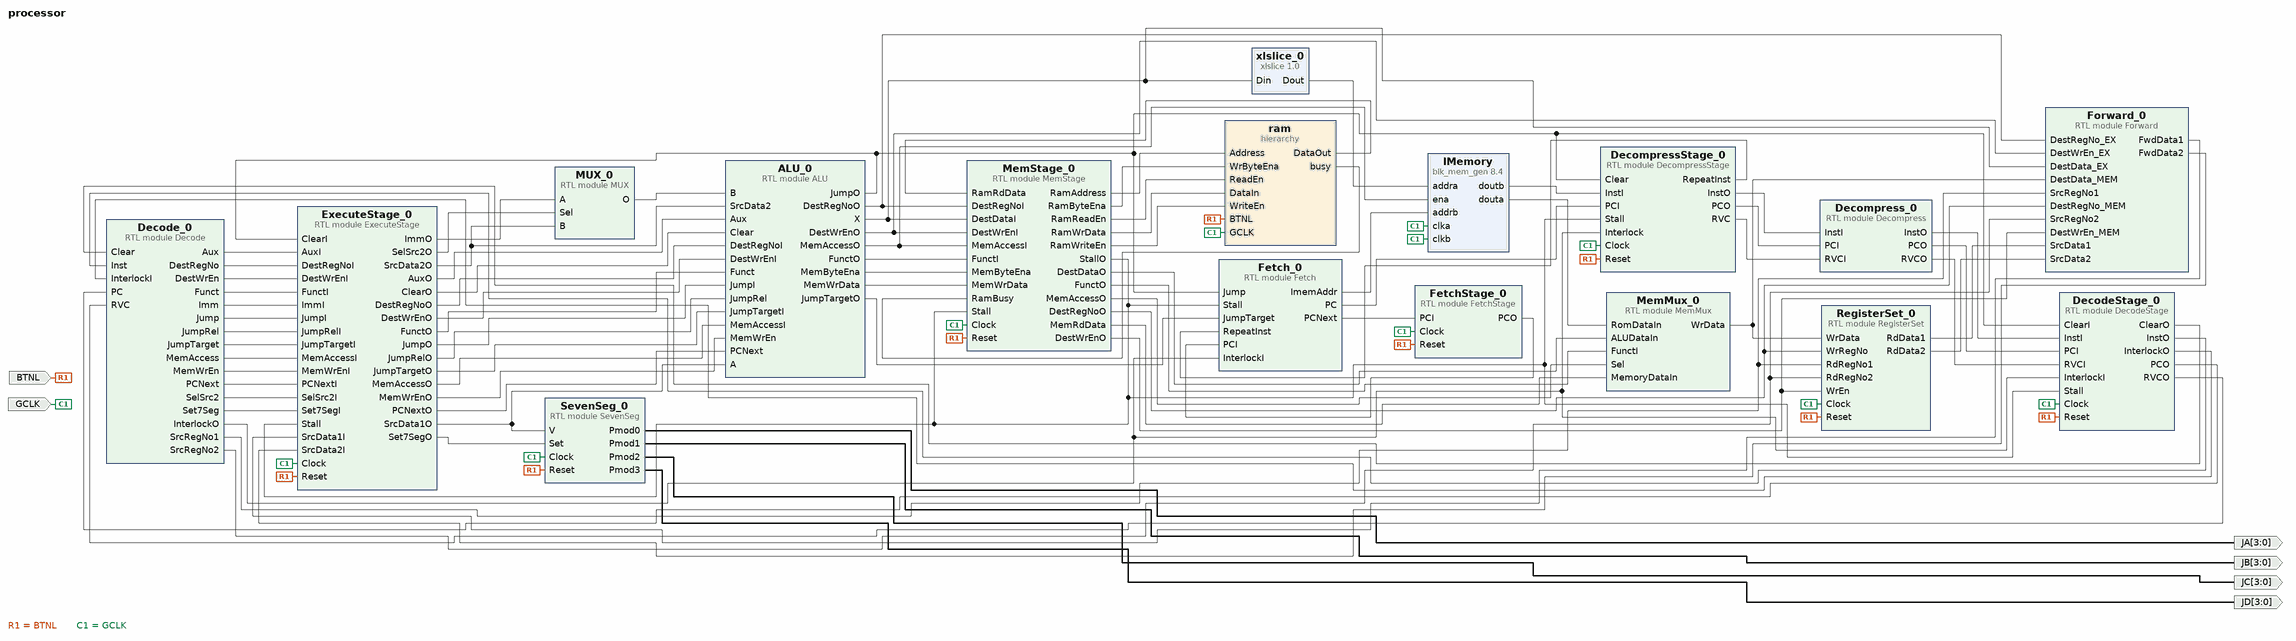
[diagram p0: block diagram of the top level]
# Vivado block design processor, xc7z020clg484-1, Vivado 2021.2
create_bd_design processor

create_bd_port -dir I GCLK
create_bd_port -dir I BTNL
create_bd_port -dir O -from 3 -to 0 JA
create_bd_port -dir O -from 3 -to 0 JB
create_bd_port -dir O -from 3 -to 0 JC
create_bd_port -dir O -from 3 -to 0 JD

create_bd_cell -type hier ram
create_bd_cell -type ip -vlnv xilinx.com:ip:blk_mem_gen:8.4 IMemory
set_property -dict [list \
  CONFIG.Coe_File ../../../../../../../../Downloads/test_files/compressed.coe \
  CONFIG.Enable_32bit_Address false \
  CONFIG.Enable_B Always_Enabled \
  CONFIG.Load_Init_File true \
  CONFIG.Memory_Type Dual_Port_ROM \
  CONFIG.Port_A_Write_Rate 0 \
  CONFIG.Port_B_Clock 100 \
  CONFIG.Port_B_Enable_Rate 100 \
  CONFIG.Register_PortA_Output_of_Memory_Primitives false \
  CONFIG.Register_PortB_Output_of_Memory_Primitives false \
  CONFIG.Use_RSTA_Pin false \
  CONFIG.Write_Depth_A 1024 \
  CONFIG.use_bram_block Stand_Alone \
] [get_bd_cells IMemory]
create_bd_cell -type ip -vlnv xilinx.com:ip:xlslice:1.0 xlslice_0
set_property -dict {CONFIG.DIN_FROM 11 CONFIG.DIN_TO 2 CONFIG.DOUT_WIDTH 10} [get_bd_cells xlslice_0]
create_bd_cell -type module -reference MUX MUX_0
create_bd_cell -type module -reference FetchStage FetchStage_0
create_bd_cell -type module -reference ExecuteStage ExecuteStage_0
create_bd_cell -type module -reference Forward Forward_0
create_bd_cell -type module -reference RegisterSet RegisterSet_0
create_bd_cell -type module -reference SevenSeg SevenSeg_0
create_bd_cell -type module -reference ALU ALU_0
create_bd_cell -type module -reference MemMux MemMux_0
create_bd_cell -type module -reference MemStage MemStage_0
create_bd_cell -type module -reference DecodeStage DecodeStage_0
create_bd_cell -type module -reference Decode Decode_0
create_bd_cell -type module -reference DecompressStage DecompressStage_0
create_bd_cell -type module -reference Decompress Decompress_0
create_bd_cell -type module -reference Fetch Fetch_0

# ---- hierarchy /ram ----
current_bd_instance /ram
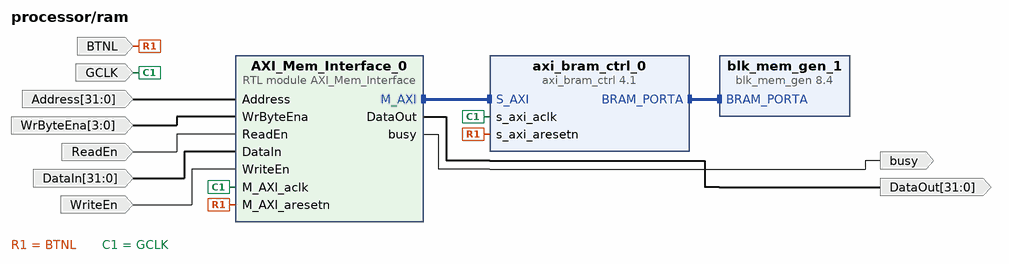
[diagram p1: block diagram inside /ram]
create_bd_pin -dir I GCLK
create_bd_pin -dir I BTNL
create_bd_pin -dir I ReadEn
create_bd_pin -dir I WriteEn
create_bd_pin -dir I -from 3 -to 0 WrByteEna
create_bd_pin -dir I -from 31 -to 0 Address
create_bd_pin -dir I -from 31 -to 0 DataIn
create_bd_pin -dir O -from 31 -to 0 DataOut
create_bd_pin -dir O busy

create_bd_cell -type ip -vlnv xilinx.com:ip:axi_bram_ctrl:4.1 axi_bram_ctrl_0
set_property -dict {CONFIG.PROTOCOL AXI4LITE CONFIG.SINGLE_PORT_BRAM 1} [get_bd_cells axi_bram_ctrl_0]
create_bd_cell -type ip -vlnv xilinx.com:ip:blk_mem_gen:8.4 blk_mem_gen_1
create_bd_cell -type module -reference AXI_Mem_Interface AXI_Mem_Interface_0

# ---- connections ----

current_bd_instance /ram
connect_bd_intf_net [get_bd_intf_pins AXI_Mem_Interface_0/M_AXI] [get_bd_intf_pins axi_bram_ctrl_0/S_AXI]
connect_bd_intf_net [get_bd_intf_pins axi_bram_ctrl_0/BRAM_PORTA] [get_bd_intf_pins blk_mem_gen_1/BRAM_PORTA]
connect_bd_net [get_bd_pins AXI_Mem_Interface_0/DataOut] [get_bd_pins DataOut]
connect_bd_net [get_bd_pins AXI_Mem_Interface_0/busy] [get_bd_pins busy]
connect_bd_net -net BTNL_1 [get_bd_pins BTNL] [get_bd_pins axi_bram_ctrl_0/s_axi_aresetn] [get_bd_pins AXI_Mem_Interface_0/M_AXI_aresetn]
connect_bd_net [get_bd_pins GCLK] [get_bd_pins axi_bram_ctrl_0/s_axi_aclk] [get_bd_pins AXI_Mem_Interface_0/M_AXI_aclk]
connect_bd_net -net MemStage_0_RamAddress [get_bd_pins Address] [get_bd_pins AXI_Mem_Interface_0/Address]
connect_bd_net -net MemStage_0_RamByteEn [get_bd_pins WrByteEna] [get_bd_pins AXI_Mem_Interface_0/WrByteEna]
connect_bd_net -net MemStage_0_RamReadEn [get_bd_pins ReadEn] [get_bd_pins AXI_Mem_Interface_0/ReadEn]
connect_bd_net -net MemStage_0_RamWrData [get_bd_pins DataIn] [get_bd_pins AXI_Mem_Interface_0/DataIn]
connect_bd_net -net MemStage_0_RamWriteEn [get_bd_pins WriteEn] [get_bd_pins AXI_Mem_Interface_0/WriteEn]
set_property HDL_ATTRIBUTE.DEBUG true [get_bd_nets BTNL_1]

current_bd_instance /
connect_bd_net [get_bd_pins ALU_0/DestRegNoO] [get_bd_pins Forward_0/DestRegNo_EX] [get_bd_pins MemStage_0/DestRegNoI]
connect_bd_net [get_bd_pins ALU_0/DestWrEnO] [get_bd_pins Forward_0/DestWrEn_EX] [get_bd_pins MemStage_0/DestWrEnI]
connect_bd_net [get_bd_pins ALU_0/FunctO] [get_bd_pins MemStage_0/FunctI]
connect_bd_net [get_bd_pins ALU_0/JumpO] \
  [get_bd_pins ExecuteStage_0/ClearI] [get_bd_pins DecodeStage_0/ClearI] [get_bd_pins DecompressStage_0/Clear] \
  [get_bd_pins Fetch_0/Jump]
connect_bd_net [get_bd_pins ALU_0/JumpTargetO] [get_bd_pins Fetch_0/JumpTarget]
connect_bd_net [get_bd_pins ALU_0/MemAccessO] [get_bd_pins IMemory/ena] [get_bd_pins MemStage_0/MemAccessI]
connect_bd_net [get_bd_pins ALU_0/MemByteEna] [get_bd_pins MemStage_0/MemByteEna]
connect_bd_net -net ALU_0_MemWrData [get_bd_pins ALU_0/MemWrData] [get_bd_pins MemStage_0/MemWrData]
connect_bd_net -net ALU_0_X [get_bd_pins ALU_0/X] [get_bd_pins xlslice_0/Din] [get_bd_pins Forward_0/DestData_EX] [get_bd_pins MemStage_0/DestDataI]
connect_bd_net -net AXI_Mem_Interface_0_DataOut [get_bd_pins ram/DataOut] [get_bd_pins MemStage_0/RamRdData]
connect_bd_net -net AXI_Mem_Interface_0_busy [get_bd_pins ram/busy] [get_bd_pins MemStage_0/RamBusy]
connect_bd_net -net BTNL_1 [get_bd_ports BTNL] \
  [get_bd_pins ram/BTNL] [get_bd_pins FetchStage_0/Reset] [get_bd_pins ExecuteStage_0/Reset] \
  [get_bd_pins RegisterSet_0/Reset] [get_bd_pins SevenSeg_0/Reset] [get_bd_pins MemStage_0/Reset] \
  [get_bd_pins DecodeStage_0/Reset] [get_bd_pins DecompressStage_0/Reset]
connect_bd_net [get_bd_pins DecodeStage_0/ClearO] [get_bd_pins Decode_0/Clear]
connect_bd_net -net DecodeStage_0_InstO [get_bd_pins DecodeStage_0/InstO] [get_bd_pins Decode_0/Inst]
connect_bd_net [get_bd_pins DecodeStage_0/InterlockO] [get_bd_pins Decode_0/InterlockI]
connect_bd_net -net DecodeStage_0_PCO [get_bd_pins DecodeStage_0/PCO] [get_bd_pins Decode_0/PC]
connect_bd_net [get_bd_pins DecodeStage_0/RVCO] [get_bd_pins Decode_0/RVC]
connect_bd_net [get_bd_pins Decode_0/Aux] [get_bd_pins ExecuteStage_0/AuxI]
connect_bd_net [get_bd_pins Decode_0/DestRegNo] [get_bd_pins ExecuteStage_0/DestRegNoI]
connect_bd_net [get_bd_pins Decode_0/DestWrEn] [get_bd_pins ExecuteStage_0/DestWrEnI]
connect_bd_net [get_bd_pins Decode_0/Funct] [get_bd_pins ExecuteStage_0/FunctI]
connect_bd_net [get_bd_pins Decode_0/Imm] [get_bd_pins ExecuteStage_0/ImmI]
connect_bd_net [get_bd_pins Decode_0/InterlockO] \
  [get_bd_pins DecodeStage_0/InterlockI] [get_bd_pins DecompressStage_0/Interlock] [get_bd_pins Fetch_0/InterlockI]
connect_bd_net [get_bd_pins Decode_0/Jump] [get_bd_pins ExecuteStage_0/JumpI]
connect_bd_net [get_bd_pins Decode_0/JumpRel] [get_bd_pins ExecuteStage_0/JumpRelI]
connect_bd_net [get_bd_pins Decode_0/JumpTarget] [get_bd_pins ExecuteStage_0/JumpTargetI]
connect_bd_net [get_bd_pins Decode_0/MemAccess] [get_bd_pins ExecuteStage_0/MemAccessI]
connect_bd_net [get_bd_pins Decode_0/MemWrEn] [get_bd_pins ExecuteStage_0/MemWrEnI]
connect_bd_net [get_bd_pins Decode_0/PCNext] [get_bd_pins ExecuteStage_0/PCNextI]
connect_bd_net [get_bd_pins Decode_0/SelSrc2] [get_bd_pins ExecuteStage_0/SelSrc2I]
connect_bd_net [get_bd_pins Decode_0/Set7Seg] [get_bd_pins ExecuteStage_0/Set7SegI]
connect_bd_net [get_bd_pins Decode_0/SrcRegNo1] [get_bd_pins Forward_0/SrcRegNo1] [get_bd_pins RegisterSet_0/RdRegNo1]
connect_bd_net [get_bd_pins Decode_0/SrcRegNo2] [get_bd_pins Forward_0/SrcRegNo2] [get_bd_pins RegisterSet_0/RdRegNo2]
connect_bd_net [get_bd_pins DecompressStage_0/InstO] [get_bd_pins Decompress_0/InstI]
connect_bd_net [get_bd_pins DecompressStage_0/PCO] [get_bd_pins Decompress_0/PCI]
connect_bd_net [get_bd_pins DecompressStage_0/RVC] [get_bd_pins Decompress_0/RVCI]
connect_bd_net [get_bd_pins DecompressStage_0/RepeatInst] [get_bd_pins Fetch_0/RepeatInst]
connect_bd_net [get_bd_pins Decompress_0/InstO] [get_bd_pins DecodeStage_0/InstI]
connect_bd_net [get_bd_pins Decompress_0/PCO] [get_bd_pins DecodeStage_0/PCI]
connect_bd_net [get_bd_pins Decompress_0/RVCO] [get_bd_pins DecodeStage_0/RVCI]
connect_bd_net [get_bd_pins ExecuteStage_0/AuxO] [get_bd_pins ALU_0/Aux]
connect_bd_net [get_bd_pins ExecuteStage_0/ClearO] [get_bd_pins ALU_0/Clear]
connect_bd_net [get_bd_pins ExecuteStage_0/DestRegNoO] [get_bd_pins ALU_0/DestRegNoI]
connect_bd_net [get_bd_pins ExecuteStage_0/DestWrEnO] [get_bd_pins ALU_0/DestWrEnI]
connect_bd_net -net ExecuteStage_0_FunctO [get_bd_pins ExecuteStage_0/FunctO] [get_bd_pins ALU_0/Funct]
connect_bd_net [get_bd_pins ExecuteStage_0/ImmO] [get_bd_pins MUX_0/A]
connect_bd_net [get_bd_pins ExecuteStage_0/JumpO] [get_bd_pins ALU_0/JumpI]
connect_bd_net [get_bd_pins ExecuteStage_0/JumpRelO] [get_bd_pins ALU_0/JumpRel]
connect_bd_net [get_bd_pins ExecuteStage_0/JumpTargetO] [get_bd_pins ALU_0/JumpTargetI]
connect_bd_net -net ExecuteStage_0_MemAccessO [get_bd_pins ExecuteStage_0/MemAccessO] [get_bd_pins ALU_0/MemAccessI]
connect_bd_net -net ExecuteStage_0_MemWrEnO [get_bd_pins ExecuteStage_0/MemWrEnO] [get_bd_pins ALU_0/MemWrEn]
connect_bd_net [get_bd_pins ExecuteStage_0/PCNextO] [get_bd_pins ALU_0/PCNext]
connect_bd_net [get_bd_pins ExecuteStage_0/SelSrc2O] [get_bd_pins MUX_0/Sel]
connect_bd_net [get_bd_pins ExecuteStage_0/Set7SegO] [get_bd_pins SevenSeg_0/Set]
connect_bd_net -net ExecuteStage_0_SrcData1O [get_bd_pins ExecuteStage_0/SrcData1O] [get_bd_pins SevenSeg_0/V] [get_bd_pins ALU_0/A]
connect_bd_net [get_bd_pins ExecuteStage_0/SrcData2O] [get_bd_pins MUX_0/B] [get_bd_pins ALU_0/SrcData2]
connect_bd_net [get_bd_pins FetchStage_0/PCO] [get_bd_pins Fetch_0/PCI]
connect_bd_net [get_bd_pins Fetch_0/ImemAddr] [get_bd_pins IMemory/addrb]
connect_bd_net [get_bd_pins Fetch_0/PC] [get_bd_pins DecompressStage_0/PCI]
connect_bd_net [get_bd_pins Fetch_0/PCNext] [get_bd_pins FetchStage_0/PCI]
connect_bd_net [get_bd_pins Forward_0/FwdData1] [get_bd_pins ExecuteStage_0/SrcData1I]
connect_bd_net [get_bd_pins Forward_0/FwdData2] [get_bd_pins ExecuteStage_0/SrcData2I]
connect_bd_net [get_bd_ports GCLK] \
  [get_bd_pins ram/GCLK] [get_bd_pins IMemory/clka] [get_bd_pins IMemory/clkb] [get_bd_pins FetchStage_0/Clock] \
  [get_bd_pins ExecuteStage_0/Clock] [get_bd_pins RegisterSet_0/Clock] [get_bd_pins SevenSeg_0/Clock] \
  [get_bd_pins MemStage_0/Clock] [get_bd_pins DecodeStage_0/Clock] [get_bd_pins DecompressStage_0/Clock]
connect_bd_net [get_bd_pins IMemory/douta] [get_bd_pins MemMux_0/RomDataIn]
connect_bd_net [get_bd_pins IMemory/doutb] [get_bd_pins DecompressStage_0/InstI]
connect_bd_net -net MUX_0_O [get_bd_pins MUX_0/O] [get_bd_pins ALU_0/B]
connect_bd_net -net MemMux_0_WrData [get_bd_pins MemMux_0/WrData] [get_bd_pins Forward_0/DestData_MEM] [get_bd_pins RegisterSet_0/WrData]
connect_bd_net [get_bd_pins MemStage_0/DestDataO] [get_bd_pins MemMux_0/ALUDataIn]
connect_bd_net [get_bd_pins MemStage_0/DestRegNoO] [get_bd_pins Forward_0/DestRegNo_MEM] [get_bd_pins RegisterSet_0/WrRegNo]
connect_bd_net [get_bd_pins MemStage_0/DestWrEnO] [get_bd_pins Forward_0/DestWrEn_MEM] [get_bd_pins RegisterSet_0/WrEn]
connect_bd_net [get_bd_pins MemStage_0/FunctO] [get_bd_pins MemMux_0/FunctI]
connect_bd_net [get_bd_pins MemStage_0/MemAccessO] [get_bd_pins MemMux_0/Sel]
connect_bd_net [get_bd_pins MemStage_0/MemRdData] [get_bd_pins MemMux_0/MemoryDataIn]
connect_bd_net [get_bd_pins MemStage_0/RamAddress] [get_bd_pins ram/Address]
connect_bd_net -net MemStage_0_RamByteEn [get_bd_pins MemStage_0/RamByteEna] [get_bd_pins ram/WrByteEna]
connect_bd_net [get_bd_pins MemStage_0/RamReadEn] [get_bd_pins ram/ReadEn]
connect_bd_net [get_bd_pins MemStage_0/RamWrData] [get_bd_pins ram/DataIn]
connect_bd_net [get_bd_pins MemStage_0/RamWriteEn] [get_bd_pins ram/WriteEn]
connect_bd_net [get_bd_pins MemStage_0/StallO] \
  [get_bd_pins ExecuteStage_0/Stall] [get_bd_pins MemStage_0/Stall] [get_bd_pins DecodeStage_0/Stall] \
  [get_bd_pins DecompressStage_0/Stall] [get_bd_pins Fetch_0/Stall]
connect_bd_net [get_bd_pins RegisterSet_0/RdData1] [get_bd_pins Forward_0/SrcData1]
connect_bd_net [get_bd_pins RegisterSet_0/RdData2] [get_bd_pins Forward_0/SrcData2]
connect_bd_net [get_bd_pins SevenSeg_0/Pmod0] [get_bd_ports JA]
connect_bd_net [get_bd_pins SevenSeg_0/Pmod1] [get_bd_ports JB]
connect_bd_net [get_bd_pins SevenSeg_0/Pmod2] [get_bd_ports JC]
connect_bd_net [get_bd_pins SevenSeg_0/Pmod3] [get_bd_ports JD]
connect_bd_net [get_bd_pins xlslice_0/Dout] [get_bd_pins IMemory/addra]
set_property HDL_ATTRIBUTE.DEBUG true [get_bd_nets ALU_0_MemWrData]
set_property HDL_ATTRIBUTE.MARK_DEBUG true [get_bd_nets ALU_0_MemWrData]
set_property HDL_ATTRIBUTE.DEBUG true [get_bd_nets ALU_0_X]
set_property HDL_ATTRIBUTE.MARK_DEBUG true [get_bd_nets ALU_0_X]
set_property HDL_ATTRIBUTE.DEBUG true [get_bd_nets BTNL_1]
set_property HDL_ATTRIBUTE.MARK_DEBUG true [get_bd_nets BTNL_1]
set_property HDL_ATTRIBUTE.DEBUG true [get_bd_nets DecodeStage_0_InstO]
set_property HDL_ATTRIBUTE.MARK_DEBUG true [get_bd_nets DecodeStage_0_InstO]
set_property HDL_ATTRIBUTE.DEBUG true [get_bd_nets DecodeStage_0_PCO]
set_property HDL_ATTRIBUTE.MARK_DEBUG true [get_bd_nets DecodeStage_0_PCO]
set_property HDL_ATTRIBUTE.DEBUG true [get_bd_nets ExecuteStage_0_FunctO]
set_property HDL_ATTRIBUTE.MARK_DEBUG true [get_bd_nets ExecuteStage_0_FunctO]
set_property HDL_ATTRIBUTE.DEBUG true [get_bd_nets ExecuteStage_0_MemAccessO]
set_property HDL_ATTRIBUTE.MARK_DEBUG true [get_bd_nets ExecuteStage_0_MemAccessO]
set_property HDL_ATTRIBUTE.DEBUG true [get_bd_nets ExecuteStage_0_MemWrEnO]
set_property HDL_ATTRIBUTE.MARK_DEBUG true [get_bd_nets ExecuteStage_0_MemWrEnO]
set_property HDL_ATTRIBUTE.DEBUG true [get_bd_nets ExecuteStage_0_SrcData1O]
set_property HDL_ATTRIBUTE.MARK_DEBUG true [get_bd_nets ExecuteStage_0_SrcData1O]
set_property HDL_ATTRIBUTE.DEBUG true [get_bd_nets MUX_0_O]
set_property HDL_ATTRIBUTE.MARK_DEBUG true [get_bd_nets MUX_0_O]
set_property HDL_ATTRIBUTE.DEBUG true [get_bd_nets MemMux_0_WrData]
set_property HDL_ATTRIBUTE.MARK_DEBUG true [get_bd_nets MemMux_0_WrData]

# ---- address map ----
assign_bd_address -offset 0x00000000 -range 8K -target_address_space [get_bd_addr_spaces ram/AXI_Mem_Interface_0/M_AXI] [get_bd_addr_segs ram/axi_bram_ctrl_0/S_AXI/Mem0]

validate_bd_design
save_bd_design
